# EAGLE design receiver (EAGLE 6.5.0)
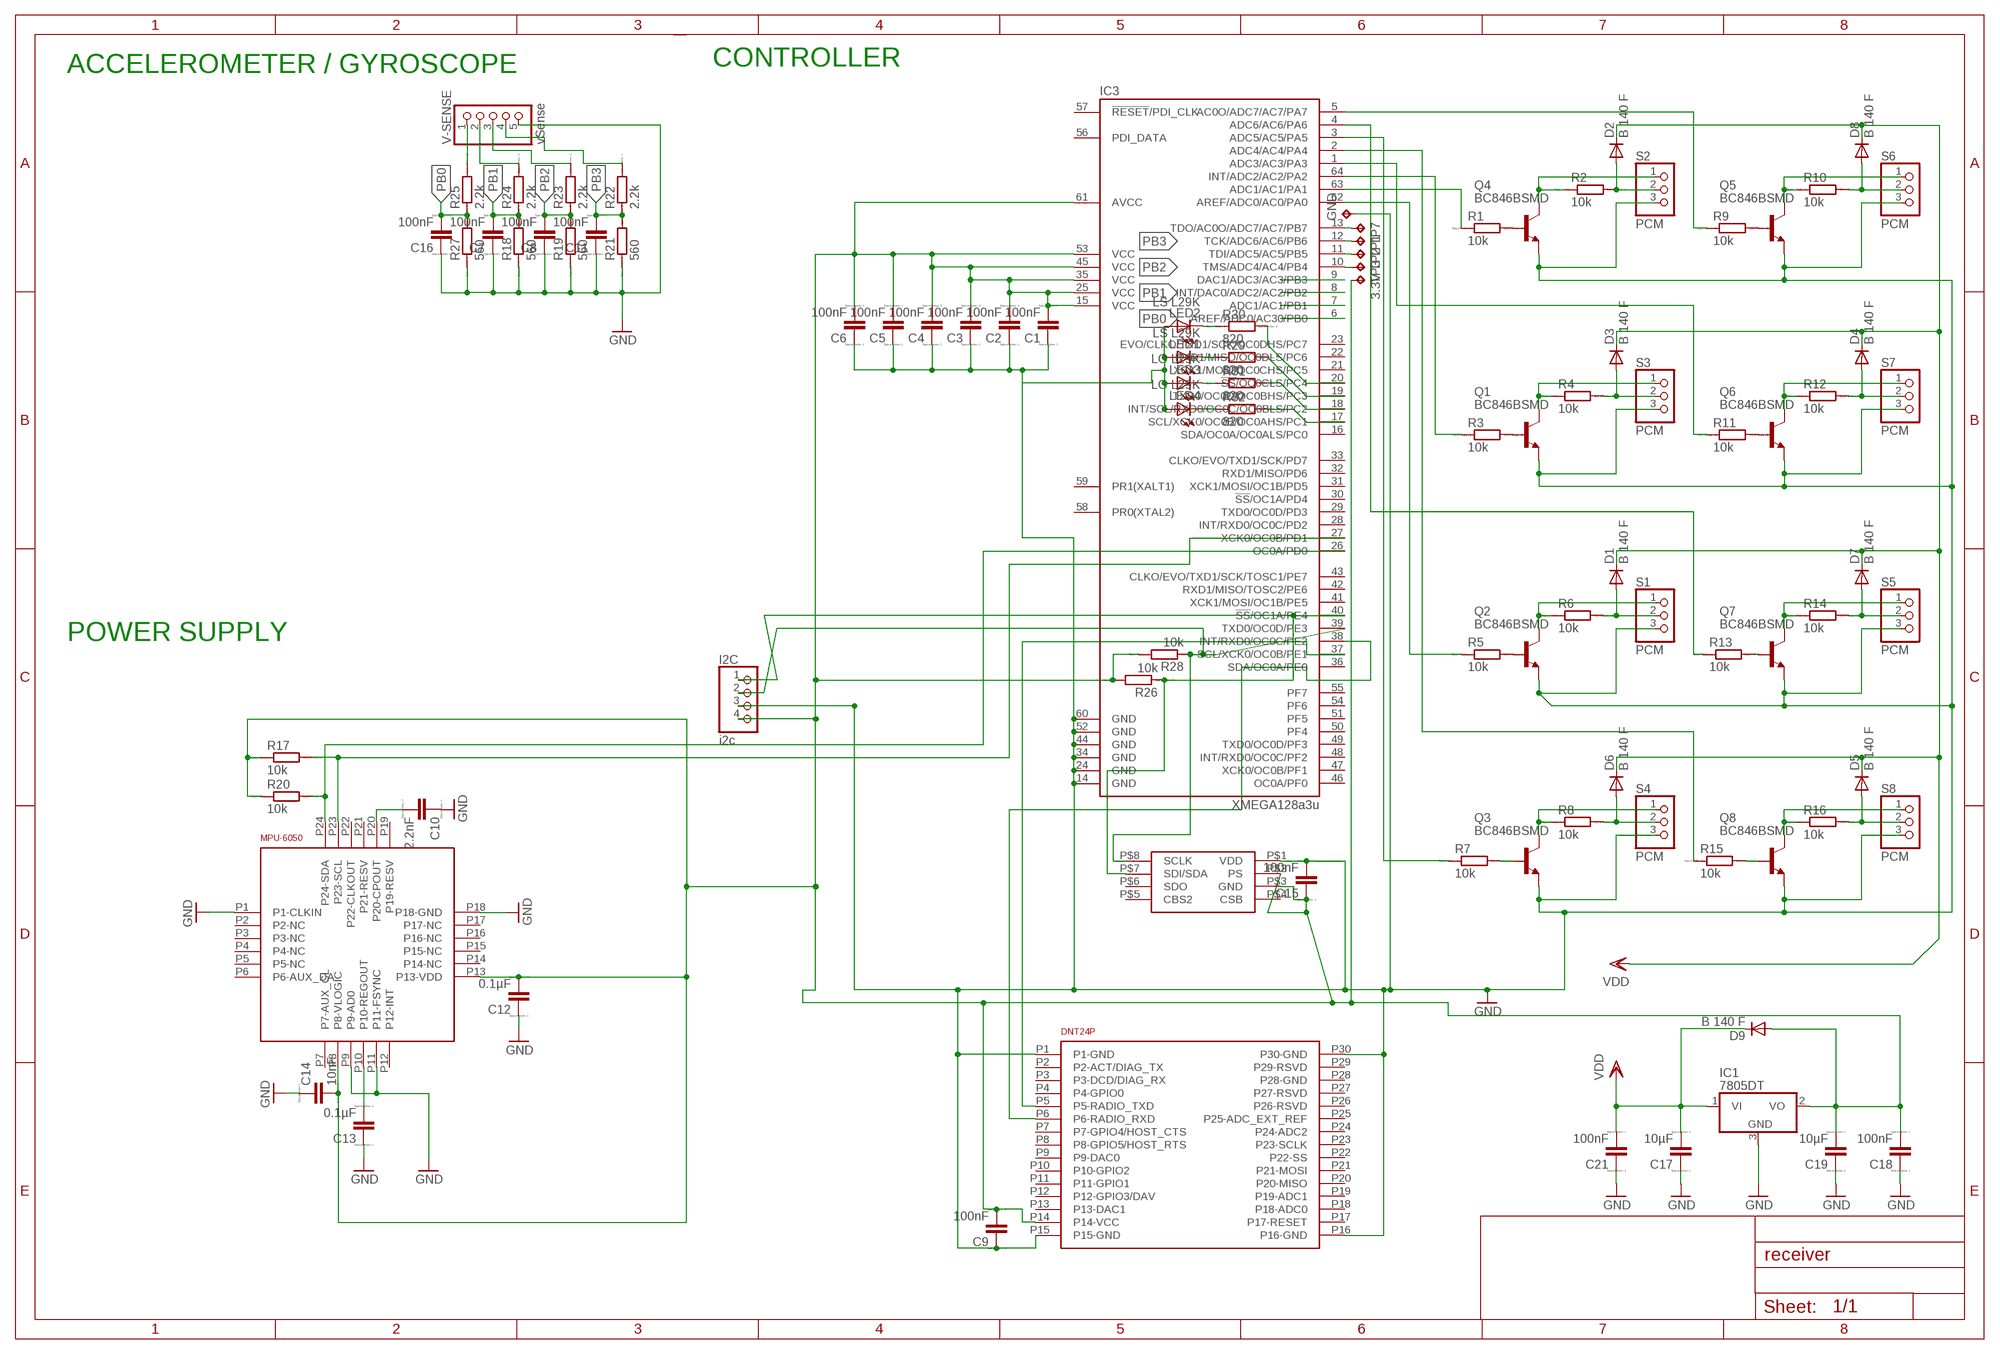
[diagram p0: schematic, sheet 1]

## Parts
3.3V  TPTP08R  [TP08R]
C1  100nF  CC0603  [C0603]
C2  100nF  CC0603  [C0603]
C3  100nF  CC0603  [C0603]
C4  100nF  CC0603  [C0603]
C5  100nF  CC0603  [C0603]
C6  100nF  CC0603  [C0603]
C7  100nF  CC0603  [C0603]
C8  100nF  CC0603  [C0603]
C9  100nF  CC0603  [C0603]
C10  2.2nF  CC0603  [C0603]
C11  100nF  CC0603  [C0603]
C12  0.1µF  CC0603  [C0603]
C13  0.1µF  CC0603  [C0603]
C14  10nF  CC0603  [C0603]
C15  100nF  CC0603  [C0603]
C16  100nF  CC0603  [C0603]
C17  10µF  CC0603  [C0603]
C18  100nF  CC0603  [C0603]
C19  10µF  CC0603  [C0603]
C21  100nF  CC0603  [C0603]
D1  B 140 F  CGRM4001-G  [SOD-123_MINI-SMA]
D2  B 140 F  CGRM4001-G  [SOD-123_MINI-SMA]
D3  B 140 F  CGRM4001-G  [SOD-123_MINI-SMA]
D4  B 140 F  CGRM4001-G  [SOD-123_MINI-SMA]
D5  B 140 F  CGRM4001-G  [SOD-123_MINI-SMA]
D6  B 140 F  CGRM4001-G  [SOD-123_MINI-SMA]
D7  B 140 F  CGRM4001-G  [SOD-123_MINI-SMA]
D8  B 140 F  CGRM4001-G  [SOD-123_MINI-SMA]
D9  B 140 F  CGRM4001-G  [SOD-123_MINI-SMA]
GND  TPTP08R  [TP08R]
I2C  i2c  PINHD-1X4/90  [1X04/90]
IC1  7805DT  [TO252]
IC3  XMEGA128a3u  ATXMEGA##A3-64A  [TQFP-64]
LED1  LS L29K  LEDCHIP-LED0603  [CHIP-LED0603]
LED2  LS L29K  LEDCHIP-LED0603  [CHIP-LED0603]
LED3  LO L29K  LEDCHIP-LED0603  [CHIP-LED0603]
LED4  LG L29K  LEDCHIP-LED0603  [CHIP-LED0603]
Q1  BC846BSMD  [SOT23]
Q2  BC846BSMD  [SOT23]
Q3  BC846BSMD  [SOT23]
Q4  BC846BSMD  [SOT23]
Q5  BC846BSMD  [SOT23]
Q6  BC846BSMD  [SOT23]
Q7  BC846BSMD  [SOT23]
Q8  BC846BSMD  [SOT23]
R1  10k  RR0603  [R0603]
R2  10k  RR0603  [R0603]
R3  10k  RR0603  [R0603]
R4  10k  RR0603  [R0603]
R5  10k  RR0603  [R0603]
R6  10k  RR0603  [R0603]
R7  10k  RR0603  [R0603]
R8  10k  RR0603  [R0603]
R9  10k  RR0603  [R0603]
R10  10k  RR0603  [R0603]
R11  10k  RR0603  [R0603]
R12  10k  RR0603  [R0603]
R13  10k  RR0603  [R0603]
R14  10k  RR0603  [R0603]
R15  10k  RR0603  [R0603]
R16  10k  RR0603  [R0603]
R17  10k  RR0603  [R0603]
R18  560  RR0603  [R0603]
R19  560  RR0603  [R0603]
R20  10k  RR0603  [R0603]
R21  560  RR0603  [R0603]
R22  2.2k  RR0603  [R0603]
R23  2.2k  RR0603  [R0603]
R24  2.2k  RR0603  [R0603]
R25  2.2k  RR0603  [R0603]
R26  10k  RR0603  [R0603]
R27  560  RR0603  [R0603]
R28  10k  RR0603  [R0603]
R29  820  RR0603  [R0603]
R30  820  RR0603  [R0603]
R31  820  RR0603  [R0603]
R32  820  RR0603  [R0603]
S1  PCM  PINHD-1X3  [1X03]
S2  PCM  PINHD-1X3  [1X03]
S3  PCM  PINHD-1X3  [1X03]
S4  PCM  PINHD-1X3  [1X03]
S5  PCM  PINHD-1X3  [1X03]
S6  PCM  PINHD-1X3  [1X03]
S7  PCM  PINHD-1X3  [1X03]
S8  PCM  PINHD-1X3  [1X03]
TP1  TPTP08R  [TP08R]
TP2  TPTP08R  [TP08R]
TP3  TPTP08R  [TP08R]
TP7  TPTP08R  [TP08R]
U$1  DNT24P_RADIO_MODULE  [DNT24P_RADIO_MODULE]
U$2  MS5611  [01BA03]
U$3  MPU-6050_ACC_GYRO  [MPU-6050_ACC_GYRO]
V-SENSE  vSense  PINHD-1X5/90  [1X05/90]

## Nets
GND: C1.1 C2.1 C3.1 C4.1 C5.1 C6.1 C7.1 C8.1 C9.1 C10.1 C11.1 C12.1 C13.1 C14.1 C15.2 C16.1 C17.1 C18.1 C19.1 C21.1 GND.TP I2C.3 IC1.3(GND) IC3.14(GND) IC3.24(GND) IC3.34(GND) IC3.44(GND) IC3.52(GND) IC3.60(GND) LED1.A LED2.A LED3.A LED4.A Q1.2(E) Q2.2(E) Q3.2(E) Q4.2(E) Q5.2(E) Q6.2(E) Q7.2(E) Q8.2(E) R18.1 R19.1 R21.1 R27.1 S1.3 S2.3 S3.3 S4.3 S5.3 S6.3 S7.3 S8.3 U$1.P1(P1-GND) U$1.P15(P15-GND) U$1.P16(P16-GND) U$1.P30(P30-GND) U$2.P$1(VDD) U$3.P1(P1-CLKIN) U$3.P9(P9-AD0) U$3.P11(P11-FSYNC) U$3.P18(P18-GND) V-SENSE.5
N$1: Q4.1(B) R1.2
N$2: Q1.3(C) R4.1 S3.1
N$3: D3.A R4.2 S3.2
N$4: Q1.1(B) R3.2
N$5: Q2.3(C) R6.1 S1.1
N$6: D1.A R6.2 S1.2
N$7: Q2.1(B) R5.2
N$8: Q3.3(C) R8.1 S4.1
N$9: D6.A R8.2 S4.2
N$10: Q3.1(B) R7.2
N$11: Q5.3(C) R10.1 S6.1
N$12: D8.A R10.2 S6.2
N$13: Q5.1(B) R9.2
N$14: Q4.3(C) R2.1 S2.1
N$15: D2.A R2.2 S2.2
N$16: Q6.3(C) R12.1 S7.1
N$17: D4.A R12.2 S7.2
N$18: Q6.1(B) R11.2
N$19: Q7.3(C) R14.1 S5.1
N$20: D7.A R14.2 S5.2
N$21: Q7.1(B) R13.2
N$22: Q8.3(C) R16.1 S8.1
N$23: D5.A R16.2 S8.2
N$24: Q8.1(B) R15.2
N$25: IC3.63(ADC1/AC1/PA1) R1.1
N$26: IC3.64(INT/ADC2/AC2/PA2) R3.1
N$27: IC3.5(AC0O/ADC7/AC7/PA7) R9.1
N$28: IC3.4(ADC6/AC6/PA6) R13.1
N$29: IC3.62(AREF/ADC0/AC0/PA0) R5.1
N$30: IC3.1(ADC3/AC3/PA3) R11.1
N$31: IC3.2(ADC4/AC4/PA4) R15.1
N$32: IC3.3(ADC5/AC5/PA5) R7.1
N$33: IC3.37(SCL/XCK0/OC0B/PE1) U$1.P5(P5-RADIO_TXD)
N$34: LED1.C R29.1
N$35: C10.2 U$3.P20(P20-CPOUT)
N$36: IC3.38(INT/RXD0/OC0C/PE2) U$1.P6(P6-RADIO_RXD)
N$37: C13.2 U$3.P10(P10-REGOUT)
N$38: IC3.10(TMS/ADC4/AC4/PB4) TP3.TP
N$39: IC3.11(TDI/ADC5/AC5/PB5) TP2.TP
N$40: IC3.12(TCK/ADC6/AC6/PB6) TP1.TP
N$41: IC3.13(TDO/AC0O/ADC7/AC7/PB7) TP7.TP
N$42: R24.2 V-SENSE.2
N$43: R23.2 V-SENSE.3
N$44: R22.2 V-SENSE.4
N$45: IC3.17(SCL/XCK0/OC0B/OC0AHS/PC1) R32.2
N$46: I2C.2 IC3.39(TXD0/OC0D/PE3) R28.1 U$2.P$8(SCLK)
N$47: I2C.1 IC3.40(!SS!/OC1A/PE4) R26.1 U$2.P$7(SDI/SDA)
N$48: IC3.18(INT/SCL/RXD0/OC0C/OC0BLS/PC2) R31.2
N$49: LED3.C R31.1
N$50: R25.2 V-SENSE.1
N$51: LED4.C R32.1
N$52: IC3.19(TXD0/OC0D/OC0BHS/PC3) R29.2
N$53: LED2.C R30.1
N$54: IC3.20(!SS!/OC0CLS/PC4) R30.2
PB0: C16.2 IC3.6(AREF/ADC0/AC30/PB0) R25.1 R27.2
PB1: C7.2 IC3.7(ADC1/AC1/PB1) R18.2 R24.1
PB2: C8.2 IC3.8(INT/DAC0/ADC2/AC2/PB2) R19.2 R23.1
PB3: C11.2 IC3.9(DAC1/ADC3/AC3/PB3) R21.2 R22.1
PF0: IC3.26(OC0A/PD0) R20.2 U$3.P24(P24-SDA)
PF1: IC3.27(XCK0/OC0B/PD1) R17.2 U$3.P23(P23-SCL)
VCC: 3.3V.TP C1.2 C2.2 C3.2 C4.2 C5.2 C6.2 C9.2 C12.2 C14.2 C15.1 C18.2 C19.2 D9.A I2C.4 IC1.2(VO) IC3.15(VCC) IC3.25(VCC) IC3.35(VCC) IC3.45(VCC) IC3.53(VCC) IC3.61(AVCC) R17.1 R20.1 R26.2 R28.2 U$1.P14(P14-VCC) U$2.P$2(PS) U$2.P$3(GND) U$3.P8(P8-VLOGIC) U$3.P13(P13-VDD)
VDD: C17.2 C21.2 D1.C D2.C D3.C D4.C D5.C D6.C D7.C D8.C D9.C IC1.1(VI)
Unconnected: IC3.16(SDA/OC0A/OC0ALS/PC0) IC3.21(XCK1/MOSI/OC0CHS/PC5) IC3.22(RXD1/MISO/OC0DLS/PC6) IC3.23(EVO/CLKO/TXD1/SCK/OC0DHS/PC7) IC3.28(INT/RXD0/OC0C/PD2) IC3.29(TXD0/OC0D/PD3) IC3.30(!SS!/OC1A/PD4) IC3.31(XCK1/MOSI/OC1B/PD5) IC3.32(RXD1/MISO/PD6) IC3.33(CLKO/EVO/TXD1/SCK/PD7) IC3.36(SDA/OC0A/PE0) IC3.41(XCK1/MOSI/OC1B/PE5) IC3.42(RXD1/MISO/TOSC2/PE6) IC3.43(CLKO/EVO/TXD1/SCK/TOSC1/PE7) IC3.46(OC0A/PF0) IC3.47(XCK0/OC0B/PF1) IC3.48(INT/RXD0/OC0C/PF2) IC3.49(TXD0/OC0D/PF3) IC3.50(PF4) IC3.51(PF5) IC3.54(PF6) IC3.55(PF7) IC3.56(PDI_DATA) IC3.57(!RESET!/PDI_CLK) IC3.58(PR0(XTAL2)) IC3.59(PR1(XALT1)) U$1.P2(P2-ACT/DIAG_TX) U$1.P3(P3-DCD/DIAG_RX) U$1.P4(P4-GPIO0) U$1.P7(P7-GPIO4/HOST_CTS) U$1.P8(P8-GPIO5/HOST_RTS) U$1.P9(P9-DAC0) U$1.P10(P10-GPIO2) U$1.P11(P11-GPIO1) U$1.P12(P12-GPIO3/DAV) U$1.P13(P13-DAC1) U$1.P17(P17-RESET) U$1.P18(P18-ADC0) U$1.P19(P19-ADC1) U$1.P20(P20-MISO) U$1.P21(P21-MOSI) U$1.P22(P22-SS) U$1.P23(P23-SCLK) U$1.P24(P24-ADC2) U$1.P25(P25-ADC_EXT_REF) U$1.P26(P26-RSVD) U$1.P27(P27-RSVD) U$1.P28(P28-GND) U$1.P29(P29-RSVD) U$2.P$4(CSB) U$2.P$5(CBS2) U$2.P$6(SDO) U$3.P2(P2-NC) U$3.P3(P3-NC) U$3.P4(P4-NC) U$3.P5(P5-NC) U$3.P6(P6-AUX_DA) U$3.P7(P7-AUX_CL) U$3.P12(P12-INT) U$3.P14(P14-NC) U$3.P15(P15-NC) U$3.P16(P16-NC) U$3.P17(P17-NC) U$3.P19(P19-RESV) U$3.P21(P21-RESV) U$3.P22(P22-CLKOUT)

## Notes on the sheet
- ACCELEROMETER / GYROSCOPE | CONTROLLER
- POWER SUPPLY

## Library data of the parts
3.3V GND TP1-TP3 TP7 = testpad:TP: Test pad
C1-C19 C21 = eagle-ltspice:C: CAPACITOR, European symbol; SPICEMODEL: NONE; SPICEPREFIX: C
D1-D9 = diode:CGRM400*-G: Molded plasitc,JEDEC SOD-123/Mini SMA Source: Comchip CGRM4001-G.pdf
I2C = pinhead:PINHD-1X4: PIN HEADER
IC1 = linear:78*: Positive VOLTAGE REGULATOR Source: http://cache.national.com/ds/LM/LM78L05.pdf http://www.fairchildsemi.com/ds/LM/LM7805.pdf
IC3 = ATxmega__A3:ATXMEGA##A3
LED1-LED4 = led:LED: LED OSRAM: - CHIPLED LG R971, LG N971, LY N971, LG Q971, LY Q971, LO R971, LY R971 LH N974, LH R974 LS Q976, LO Q976, LY Q976 LO Q996 - Hyper CHIPLED LW Q18S LB Q993, LB Q99A, LB R99A - SideLED LS A670, LO A670, LY A670, LG A670, LP A670 LB A673, LV A673, LT A673, LW A673 LH A674 LY A675 LS A676, LA A676, LO A676, LY A676, LW A676 LS A679, LY A679, LG A679 - Hyper Micro SIDELED® LS Y876, LA Y876, LO Y876, LY Y876 LT Y87S - SmartLED LW L88C, LW L88S LB L89C, LB L89S, LG L890 LS L89K, LO L89K, LY L89K LS L896, LA L896, LO L896, LY L896 - TOPLED LS T670, LO T670, LY T670, LG T670, LP T670 LSG T670, LSP T670, LSY T670, LOP T670, LYG T670 LG T671, LOG T671, LSG T671 LB T673, LV T673, LT T673, LW T673 LH T674 LS T676, LA T676, LO T676, LY T676, LB T676, LH T676, LSB T676, LW T676 LB T67C, LV T67C, LT T67C, LS T67K, LO T67K, LY T67K, LW E67C LS E67B, LA E67B, LO E67B, LY E67B, LB E67C, LV E67C, LT E67C LW T67C LS T679, LY T679, LG T679 LS T770, LO T770, LY T770, LG T770, LP T770 LB T773, LV T773, LT T773, LW T773 LH T774 LS E675, LA E675, LY E675, LS T675 LS T776, LA T776, LO T776, LY T776, LB T776 LHGB T686 LT T68C, LB T68C - Hyper Mini TOPLED® LB M676 - Mini TOPLED Santana® LG M470 LS M47K, LO M47K, LY M47K Source: http://www.osram.convergy.de LUXEON: - LUMILED® LXK2-PW12-R00, LXK2-PW12-S00, LXK2-PW14-U00, LXK2-PW14-V00 LXK2-PM12-R00, LXK2-PM12-S00, LXK2-PM14-U00 LXK2-PE12-Q00, LXK2-PE12-R00, LXK2-PE12-S00, LXK2-PE14-T00, LXK2-PE14-U00 LXK2-PB12-K00, LXK2-PB12-L00, LXK2-PB12-M00, LXK2-PB14-N00, LXK2-PB14-P00, LXK2-PB14-Q00 LXK2-PR12-L00, LXK2-PR12-M00, LXK2-PR14-Q00, LXK2-PR14-R00 LXK2-PD12-Q00, LXK2-PD12-R00, LXK2-PD12-S00 LXK2-PH12-R00, LXK2-PH12-S00 LXK2-PL12-P00, LXK2-PL12-Q00, LXK2-PL12-R00 Source: www.luxeon.com KINGBRIGHT: KA-3528ASYC Source: www.kingbright.com
Q1-Q8 = transistor-npn:BC846*: NPN Transistor
R1-R32 = eagle-ltspice:R: RESISTOR, European symbol; SPICEMODEL: NONE; SPICEPREFIX: R
S1-S8 = pinhead:PINHD-1X3: PIN HEADER
U$1 = USER PARTS:DNT24P_RADIO_MODULE
U$2 = ms5611:MS5611
U$3 = USER PARTS:MPU-6050_ACC_GYRO
V-SENSE = pinhead:PINHD-1X5: PIN HEADER

## Net classes
0 gnd: width 0.305 mm, drill 0.5 mm, clearance 0.203 mm

## Board
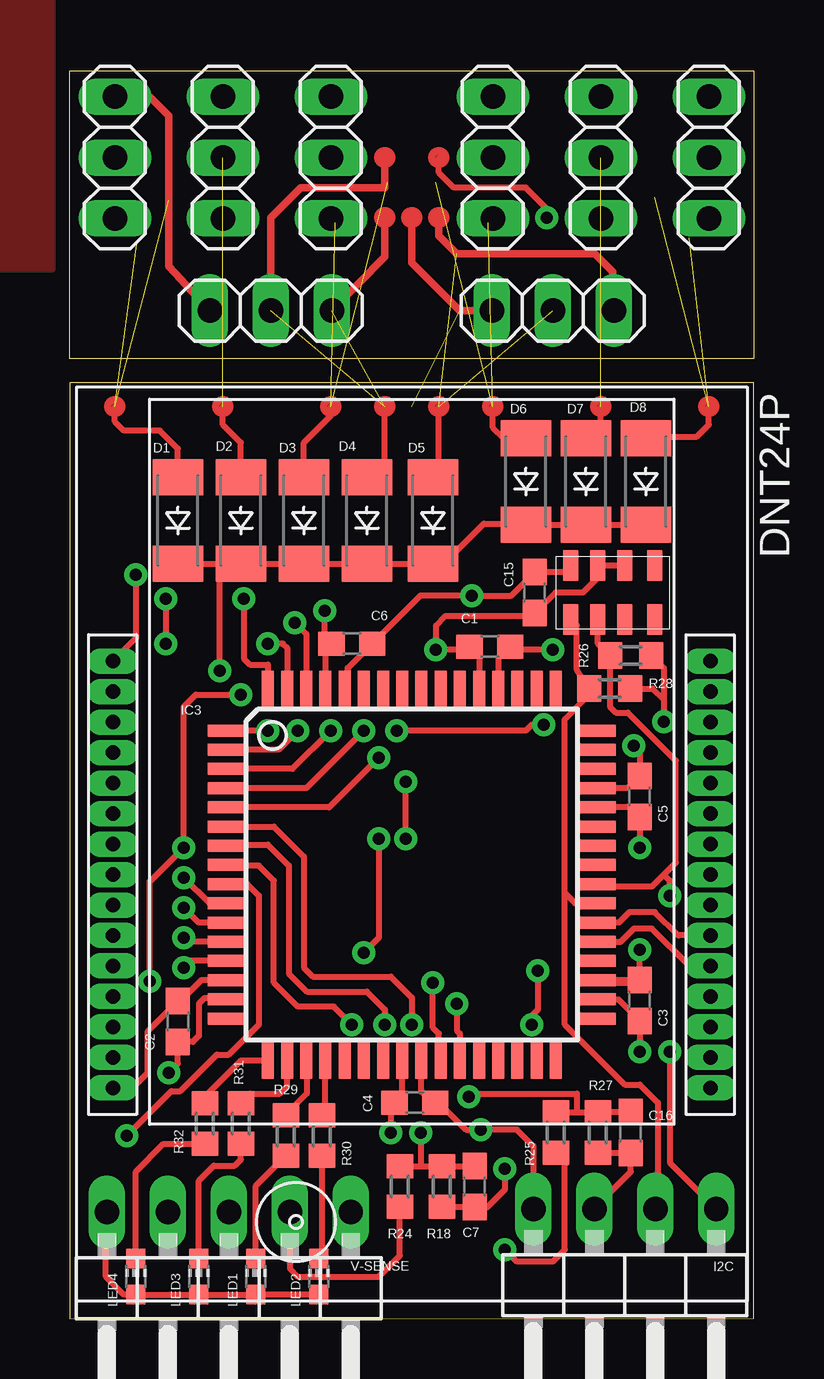
[diagram p1: board, top side]
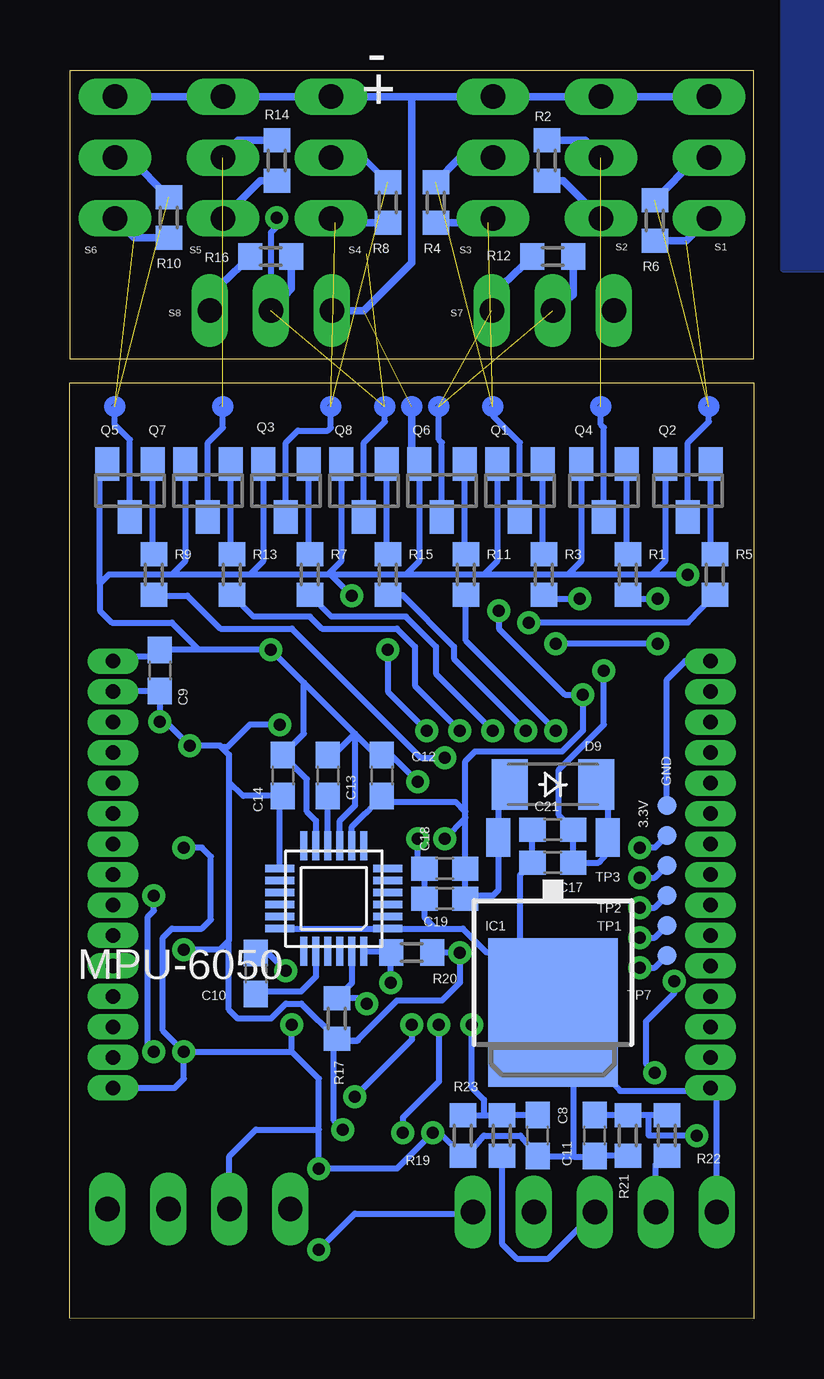
[diagram p2: board, bottom side, seen from below]

Size 28.5 x 52 mm. Coordinates in mm from the lower left corner, seen from the top.
Outline: 28.5,39 0,39 0,0 28.5,0.01 28.5,39
Outline: 0,52 28.5,52 28.5,40 0,40 0,52
Copper layers (1*2+3*4+5*6+7*16): Top 0.035mm / dielectric 0.2mm / Route2 0.035mm / dielectric 0.15mm / Route3 0.035mm / dielectric 0.2mm / Route4 0.035mm / dielectric 0.15mm / Route5 0.035mm / dielectric 0.2mm / Route6 0.035mm / dielectric 0.15mm / Route7 0.035mm / dielectric 0.2mm / Bottom 0.035mm
Design rules "Eagle_WEdirekt_150_check": minimum track width 6mil, minimum drill 0.25mm, track to track 6mil, track to pad 8mil, pad to pad 8mil, via to via 6mil, smd to smd 8mil, copper to edge 12mil, drill to drill 24mil, minimum pad ring 9mil, minimum via ring 9mil, stop-mask expansion 3mil, vias tented up to drill 0mil, thermal gap 12mil

### Footprints (pad centres in the part's own frame; a part is rotated, then mirrored left to right if it is on the bottom)
TP08R = smd 0.8 x 0.8: TP 0,0
C0603 = smd 1.1 x 1: 1 -0.85,0; 2 0.85,0
SOD-123_MINI-SMA = smd 1.5 x 2.1: A 1.8,0; C -1.8,0
1X04/90 = drill 1.016 long: 1 -3.81,-3.81; 2 -1.27,-3.81; 3 1.27,-3.81; 4 3.81,-3.81
TO252 = smd 1 x 1.6: 1 -2.28,-4.8; 2 2.28,-4.8 | smd 5.4 x 6.2: 3 0,2.5
TQFP-64 = smd 1.5 x 0.5: 1 -7.75,6; 2 -7.75,5.2; 3 -7.75,4.4; 4 -7.75,3.6; 5 -7.75,2.8; 6 -7.75,2; 7 -7.75,1.2; 8 -7.75,0.4; 9 -7.75,-0.4; 10 -7.75,-1.2; 11 -7.75,-2; 12 -7.75,-2.8; 13 -7.75,-3.6; 14 -7.75,-4.4; 15 -7.75,-5.2; 16 -7.75,-6; 33 7.75,-6; 34 7.75,-5.2; 35 7.75,-4.4; 36 7.75,-3.6; 37 7.75,-2.8; 38 7.75,-2; 39 7.75,-1.2; 40 7.75,-0.4; 41 7.75,0.4; 42 7.75,1.2; 43 7.75,2; 44 7.75,2.8; 45 7.75,3.6; 46 7.75,4.4; 47 7.75,5.2; 48 7.75,6 | smd 0.5 x 1.5: 17 -6,-7.75; 18 -5.2,-7.75; 19 -4.4,-7.75; 20 -3.6,-7.75; 21 -2.8,-7.75; 22 -2,-7.75; 23 -1.2,-7.75; 24 -0.4,-7.75; 25 0.4,-7.75; 26 1.2,-7.75; 27 2,-7.75; 28 2.8,-7.75; 29 3.6,-7.75; 30 4.4,-7.75; 31 5.2,-7.75; 32 6,-7.75; 49 6,7.75; 50 5.2,7.75; 51 4.4,7.75; 52 3.6,7.75; 53 2.8,7.75; 54 2,7.75; 55 1.2,7.75; 56 0.4,7.75; 57 -0.4,7.75; 58 -1.2,7.75; 59 -2,7.75; 60 -2.8,7.75; 61 -3.6,7.75; 62 -4.4,7.75; 63 -5.2,7.75; 64 -6,7.75
CHIP-LED0603 = smd 0.8 x 0.8: A 0,-0.75; C 0,0.75
SOT23 = smd 1 x 1.4: 1 -0.95,-1.1; 2 0.95,-1.1; 3 0,1.1
R0603 = smd 1 x 1.1: 1 -0.85,0; 2 0.85,0
1X03 = drill 1.016 long: 1 -2.54,0; 2 0,0; 3 2.54,0
DNT24P_RADIO_MODULE = drill 0.6 pad 0.889 long: P1 8.89,12.446; P2 7.62,12.446; P3 6.35,12.446; P4 5.08,12.446; P5 3.81,12.446; P6 2.54,12.446; P7 1.27,12.446; P8 0,12.446; P9 -1.27,12.446; P10 -2.54,12.446; P11 -3.81,12.446; P12 -5.08,12.446; P13 -6.35,12.446; P14 -7.62,12.446; P15 -8.89,12.446; P16 -8.89,-12.446; P17 -7.62,-12.446; P18 -6.35,-12.446; P19 -5.08,-12.446; P20 -3.81,-12.446; P21 -2.54,-12.446; P22 -1.27,-12.446; P23 0,-12.446; P24 1.27,-12.446; P25 2.54,-12.446; P26 3.81,-12.446; P27 5.08,-12.446; P28 6.35,-12.446; P29 7.62,-12.446; P30 8.89,-12.446
01BA03 = smd 1.27 x 0.635: P$1 2.625,4.125; P$2 2.625,3; P$3 2.625,1.875; P$4 2.625,0.625; P$5 0.375,0.625; P$6 0.375,1.875; P$7 0.375,3; P$8 0.375,4.125
MPU-6050_ACC_GYRO = smd 1.2 x 0.3: P1 -2.25,1.25; P2 -2.25,0.75; P3 -2.25,0.25; P4 -2.25,-0.25; P5 -2.25,-0.75; P6 -2.25,-1.25; P13 2.25,-1.25; P14 2.25,-0.75; P15 2.25,-0.25; P16 2.25,0.25; P17 2.25,0.75; P18 2.25,1.25 | smd 0.3 x 1.2: P7 -1.25,-2.2; P8 -0.75,-2.2; P9 -0.25,-2.2; P10 0.25,-2.2; P11 0.75,-2.2; P12 1.25,-2.2; P19 1.25,2.2; P20 0.75,2.2; P21 0.25,2.2; P22 -0.25,2.2; P23 -0.75,2.2; P24 -1.25,2.2
1X05/90 = drill 1.016 long: 1 -5.08,-3.81; 2 -2.54,-3.81; 3 0,-3.81; 4 2.54,-3.81; 5 5.08,-3.81

### Placement (x,y rotation side)
3.3V  3.62,20.12 90 bottom
C1  17.5,28 180 top
C2  4.5,12.38 270 top
C3  23.75,13.25 90 top
C4  14.38,9 0 top
C5  23.75,21.75 90 top
C6  11.75,28.12 180 top
C7  16.88,5.5 90 top
C8  9,7.62 90 bottom
C9  24.75,27 270 bottom
C10  20.75,14.38 270 bottom
C11  6.62,7.62 90 bottom
C12  15.5,22.62 270 bottom
C13  17.75,22.62 270 bottom
C14  19.62,22.62 270 bottom
C15  19.38,30.25 90 top
C16  23.38,7.75 90 top
C17  8.38,19 0 bottom
C18  12.88,18.75 0 bottom
C19  12.88,17.5 0 bottom
C21  8.38,20.38 0 bottom
D1  4.5,33.25 90 top
D2  7.12,33.25 90 top
D3  9.75,33.25 90 top
D4  12.38,33.25 90 top
D5  15.12,33.25 90 top
D6  19,34.88 90 top
D7  21.5,34.88 90 top
D8  24,34.88 90 top
D9  8.38,22.25 180 bottom
GND  3.62,21.38 90 bottom
I2C  23.12,0.75 180 top
IC1  8.38,15.25 180 bottom
IC3  14.25,18.5 0 top
LED1  7.75,1.75 0 top
LED2  10.38,1.75 0 top
LED3  5.38,1.75 0 top
LED4  2.75,1.75 0 top
Q1  9.75,34.5 180 bottom
Q2  2.75,34.5 180 bottom
Q3  19.5,34.5 180 bottom
Q4  6.25,34.5 180 bottom
Q5  26,34.5 180 bottom
Q6  13,34.5 180 bottom
Q7  22.75,34.5 180 bottom
Q8  16.25,34.5 180 bottom
R1  5.25,31 90 bottom
R2  8.62,48.25 90 bottom
R3  8.75,31 90 bottom
R4  13.25,46.5 90 bottom
R5  1.62,31 90 bottom
R6  4.12,45.75 90 bottom
R7  18.5,31 90 bottom
R8  15.25,46.5 90 bottom
R9  25,31 90 bottom
R10  24.38,45.88 90 bottom
R11  12,31 90 bottom
R12  8.38,44.25 0 bottom
R13  21.75,31 90 bottom
R14  19.88,48.25 90 bottom
R15  15.25,31 90 bottom
R16  20.12,44.25 0 bottom
R17  17.38,12.5 90 bottom
R18  15.5,5.5 90 top
R19  12.12,7.62 90 bottom
R20  14.25,15.25 180 bottom
R21  5.25,7.62 90 bottom
R22  3.62,7.62 270 bottom
R23  10.5,7.62 270 bottom
R24  13.75,5.5 270 top
R25  20.25,7.75 270 top
R26  23.38,27.62 0 top
R27  22,7.75 90 top
R28  22.5,26.25 0 top
R29  9,7.62 90 top
R30  10.5,7.62 90 top
R31  7.12,8.12 90 top
R32  5.62,8.12 90 top
S1  1.88,48.38 90 top
S2  6.38,48.38 90 top
S3  10.88,48.38 90 top
S4  17.62,48.38 90 top
S5  22.12,48.38 90 top
S6  26.62,48.38 90 top
S7  8.38,42 180 top
S8  20.12,42 180 top
TP1  3.62,16.38 90 bottom
TP2  3.62,17.62 90 bottom
TP3  3.62,18.88 90 bottom
TP7  3.62,15.12 90 bottom
U$1  14.25,18.5 270 top
U$2  25,28.75 90 top
U$3  17.5,17.5 180 bottom
V-SENSE  6.62,0.62 180 top

### Tracks (layer width: path | path; a pad name or v marks a point on that pad's centre or on a via)
GND  (via drill 0.5)  (1 unrouted)
  Top 0.254: v2.75,31 2.75,28.34 U$1.P16 | C6.1 12.47,27.9 12.75,28.05 | v23.75,19.62 C5.1 23.35,21.3 IC3.44 | v23.75,11.12 C3.1 22.85,13.3 IC3.34 | C1.1 18.25,28.1 | C6.1 11.57,27.1 IC3.60 | C1.1 17.85,27.5 IC3.52 | IC3.24 13.85,9.45 C4.1 13.38,8.97 v13.38,7.75 | v20.12,27.88 18.48,27.88 C1.1 | R27.1 C16.1 23.38,6.12 21.86,4.61 I2C.3 | R18.1 C7.1 16.9,4.65 16.88,4.62 17.38,4.62 18.12,5.38 v18.12,6.25 | U$2.P$1 20.6,31.1 C15.2 18.4,30.12 v16.75,30.12 14.6,30.12 C6.1 | v19.5,14.5 19.5,12.88 19.25,12.62 v19.25,12.25 | IC3.14 5.47,14.1 4.62,13.25 C2.1 3.25,11.97 3.25,10.25 2.62,9.62 2.44,9.62 U$1.P30 | 12.62,28.12 C6.1 | V-SENSE.5 1.5,4.39 1.5,1.75 2.25,1 LED4.A LED3.A LED1.A LED2.A | v14,20 v14,22.38
  Top 0.305: S1.3 3.33,50.91 4.12,50.12 4.12,43.84 S7.3 | S8.3 16.25,42 14.25,44 14.25,45.88
  Bottom 0.254: v2.75,31 4.25,31 | 4.25,31 7.75,31 | 7.75,31 11.25,31 | 11.25,31 14.5,31 | 14.5,31 17.62,31 | 17.62,31 17.75,31 | 17.75,31 21,31 | 21,31 24.25,31 | 24.25,31 26.88,31 27.25,30.62 | 27.25,35.3 Q5.2 | 7.75,31 7.2,31.55 Q4.2 | Q1.2 10.7,31.55 11.25,31 | 14.5,31 13.95,31.55 Q6.2 14.25,35.9 | 17.75,31 17.2,31.55 Q8.2 17.2,36.05 | Q3.2 20.45,31.55 21,31 | Q7.2 23.7,31.55 24.25,31 | U$1.P15 26.49,27.6 25,27.6 C9.1 24.73,27.88 23.12,27.88 | 23.12,27.88 v20.12,27.88 18.75,26.5 | v23.75,19.62 23,19.62 22.62,19.25 22.62,16.62 23,16.25 24.25,16.25 24.62,15.88 24.62,12 v23.75,11.12 | 19.25,11.12 18.12,10 18.12,7.88 | 16.62,24.38 16.62,21.38 17.25,20.75 U$3.P9 | 27.25,30.62 27.25,29.5 26.75,29 24.25,29 23.12,27.88 | 13.25,16.25 U$3.P1 U$3.P18 | 13.25,16.25 12.12,16.25 11.12,15.25 10,15.25 9.75,15 | U$3.P11 18.25,20.75 18.62,21.12 18.62,22.48 C14.1 19.62,23.5 18.75,24.38 18.75,26.5 | 27.25,30.62 27.25,35 26.95,35.3 Q5.2 | 7.5,10 8.75,10 | V-SENSE.5 1.54,9.35 U$1.P30 1.93,9.48 5.57,9.48 6.56,10.47 6.26,11.99 | 18.12,7.88 v18.12,6.25 14.88,6.25 v13.38,7.75 13.1,7.75 R19.1 11.9,6.5 11.9,6.85 11.25,7.62 9.72,7.62 C8.1 8.47,6.75 7.5,6.75 | 4.25,31 3.7,31.55 Q2.2 | 17.62,31 v16.75,30.12 | v19.5,14.5 20.23,15.22 C10.1 | v23.75,11.12 19.25,11.12 | U$1.P16 2.86,27.39 3.62,26.62 GND.TP | 16.62,24.38 17.38,23.62 17.38,23.5 17.6,23.38 C13.1 17.9,23.73 | 9.75,15 9.75,12.5 IC1.3 6.5,12.22 6.26,11.99 | 9.25,20 C21.1 C17.1 9.75,18.48 9.75,15 | 16.62,24.38 15.88,23.62 15.78,23.5 C12.1 15.1,23.48 v14,22.38 | 13.25,16.25 13.72,16.73 C19.1 C18.1 14,18.9 v14,20 | 19.25,11.12 v19.25,12.25 | U$1.P1 24.14,9.61 23.75,10 v23.75,11.12 | 27.25,35.9 Q5.2
  Bottom 0.254: R21.1 C11.1 6.65,6.75 7.5,6.75 | 7.5,6.75 7.5,10 | 7.5,10 7.5,10.75 6.26,11.99 | 16.62,24.38 18.75,26.5 | I2C.3 21.86,6.77 20.75,7.88 18.12,7.88
  Bottom 0.305: S1.3 S2.3 S3.3 14.25,50.91 | S4.3 S5.3 S6.3 | S8.3 16.25,42 14.25,44 14.25,50.91 | 16.66,50.91 S4.3 | 14.25,38 14.25,35.9 | 14.25,50.91 S4.3
N$1
  Bottom 0.254: R1.2 5.3,32.02 Q4.1
N$2  (1 unrouted)
  Bottom 0.254: Q1.3 9.75,36.5 10.88,37.62 10.88,38
  Bottom 0.305: R4.1 11.06,45.65 S3.1
N$3  (1 unrouted)
  Top 0.254: D3.A 9.75,36.5 10.88,37.62 10.88,38
  Bottom 0.305: R4.2 12.28,48.35 S3.2
N$4
  Bottom 0.254: R3.2 8.8,32.15 Q1.1
N$5  (1 unrouted)
  Bottom 0.254: Q2.3 2.75,36.5 1.88,37.38 1.88,38
  Bottom 0.305: R6.1 2.81,44.9 S1.1
N$6  (1 unrouted)
  Top 0.254: D1.A 4.5,36.25 3.75,37 2.25,37 1.88,37.38 1.88,38
  Bottom 0.305: R6.2 2.4,48.35 S1.2
N$7
  Bottom 0.254: R5.2 1.8,32.02 Q2.1
N$8  (1 unrouted)
  Bottom 0.254: Q3.3 19.5,36.5 19,37 17.75,37 17.62,37.12 17.62,38
  Bottom 0.305: R8.1 17.43,45.65 S4.1
N$9  (1 unrouted)
  Top 0.254: 17.62,38 17.62,37.12 18.07,36.67 D6.A
  Bottom 0.254: S4.2 16.27,48.38 R8.2
N$10
  Bottom 0.254: R7.2 18.55,32.27 Q3.1
N$11  (1 unrouted)
  Bottom 0.254: Q5.3 26,36.62 26.62,37.25 26.62,38
  Bottom 0.305: R10.1 25.81,45.02 S6.1
N$12  (1 unrouted)
  Top 0.254: D8.A 24.12,36.75 26.12,36.75 26.62,37.25 26.62,38
  Bottom 0.305: R10.2 25.98,48.35 S6.2
N$13
  Bottom 0.254: R9.2 25.05,31.9 Q5.1
N$14  (1 unrouted)
  Bottom 0.254: Q4.3 6.25,37.12 6.38,37.25 6.38,38
  Bottom 0.305: R2.1 7.94,47.4 S2.1
N$15  (1 unrouted)
  Top 0.254: D2.A 7.12,36.5 6.38,37.25 6.38,38
  Bottom 0.305: R2.2 7.03,49.1 S2.2
N$16  (1 unrouted)
  Top 0.305: S7.1 13.12,44.25 13.12,45.88
  Bottom 0.254: Q6.3 13,36.5 13.12,36.62 13.12,38
  Bottom 0.305: R12.1 10.85,42.69 S7.1
N$17  (1 unrouted)
  Top 0.254: D4.A 13.12,35.62 13.12,38
  Top 0.305: S7.2 8.38,45.88 9.62,47.12 13.12,47.12 13.12,48.38
  Bottom 0.305: R12.2 7.53,42.65 S7.2
N$18
  Bottom 0.254: R11.2 12.05,32.02 Q6.1
N$19  (1 unrouted)
  Bottom 0.254: Q7.3 22.75,36.5 22.12,37.12 22.12,38
  Bottom 0.305: R14.1 20.56,47.4 S5.1
N$20  (1 unrouted)
  Top 0.254: D7.A 21.5,36.5 22.12,37 22.12,38
  Bottom 0.305: R14.2 21.48,49.1 S5.2
N$21
  Bottom 0.254: R13.2 21.8,32.15 Q7.1
N$22  (1 unrouted)
  Top 0.305: S8.1 22.62,43.62 21.88,44.38 16.12,44.38 15.38,45.12 15.38,45.88
  Bottom 0.254: Q8.3 16.25,36.5 15.38,37.38 15.38,38
  Bottom 0.305: R16.1 22.6,42.69 S8.1
N$23  (via drill 0.5)  (1 unrouted)
  Top 0.254: D5.A 15.38,35.62 15.38,38 | v19.88,45.88 19.88,46.25 19,47.12 16,47.12 15.38,47.75 15.38,48.38
  Bottom 0.254: v19.88,45.88 19.88,45.5 20.12,45.25 S8.2
  Bottom 0.305: R16.2 19.27,42.9 S8.2
N$24
  Bottom 0.254: R15.2 15.3,32.27 Q8.1
N$25  (via drill 0.5, 0.5 pad 0.25)
  Top 0.254: v4,30 v4,28.12 | IC3.63 9.05,27.95 8.88,28.12 v8.25,28.12
  Bottom 0.254: R1.1 4.75,30 v4,30 | v4,28.12 v8.25,28.12
N$26  (via drill 0.5)
  Top 0.254: v7.25,30 7.25,27.5 7.5,27.25 8.25,27.25 IC3.64
  Bottom 0.254: R3.1 8.62,30.02 8.62,30 v7.25,30
N$27  (via drill 0.5)
  Top 0.254: v12.88,23.38 10.8,21.3 IC3.5
  Bottom 0.254: R9.1 24.88,30.12 23.6,30.12 22.23,28.75 19.25,28.75 13.88,23.38 v12.88,23.38
N$28  (via drill 0.5)
  Top 0.254: v12.25,24.5 9.85,22.1 IC3.4
  Bottom 0.254: 21.65,30.25 R13.1 20.85,29.25 18.5,29.25 18,28.75 14.88,28.75 14.12,28 14.12,26.38 v12.25,24.5
N$29  (via drill 0.5)
  Top 0.254: IC3.62 9.85,28.52 v9.38,29
  Bottom 0.254: R5.1 2.75,29 v9.38,29
N$30  (via drill 0.5)
  Top 0.254: v8.25,24.5 IC3.1
  Bottom 0.254: v8.25,24.5 12,28.25 R11.1
N$31  (via drill 0.5)
  Top 0.254: v9.5,24.5 8.7,23.7 IC3.2
  Bottom 0.254: R15.1 14.65,30.15 12.5,28 12.5,27.5 v9.5,24.5
N$32  (via drill 0.5)
  Top 0.254: v10.88,24.5 9.28,22.9 IC3.3
  Bottom 0.254: v10.88,24.5 13.25,26.88 13.25,28 14.5,29.25 17.6,29.25 R7.1
N$33
  Top 0.254: U$1.P5 25.81,14.69 24.25,16.25 23.5,16.25 22.94,15.69 22.01,15.69 IC3.37
N$34
  Top 0.254: LED1.C 7.75,5.53 R29.1
N$35
  Bottom 0.254: 20.73,13.53 C10.2 | U$3.P20 18.25,14.25 18.88,13.62 20.52,13.62 C10.2 | 20.6,13.53 C10.2
N$36
  Top 0.254: U$1.P6 25.35,15.96 24.38,16.94 23.31,16.94 22.88,16.5 IC3.38
N$37
  Bottom 0.254: U$3.P10 C13.2
N$38  (via drill 0.5)
  Top 0.254: IC3.10 5.83,17.3 v4.75,18.38
  Bottom 0.254: v4.75,18.38 4.12,18.38 TP3.TP
N$39  (via drill 0.5)
  Top 0.254: IC3.11 5.38,16.5 v4.75,17.12
  Bottom 0.254: v4.75,17.12 4.12,17.12 TP2.TP
N$40  (via drill 0.5)
  Top 0.254: IC3.12 4.92,15.7 v4.75,15.88
  Bottom 0.254: v4.75,15.88 4.12,15.88 TP1.TP
N$41  (via drill 0.5)
  Top 0.254: IC3.13 5.03,14.9 v4.75,14.62
  Bottom 0.254: v4.75,14.62 4.12,14.62 TP7.TP
N$42
  Top 0.254: V-SENSE.2 9.16,2.08 9.5,1.75 12.88,1.75 13.75,2.62 R24.2
N$43
  Bottom 0.254: R23.2 10.5,3.12 9.88,2.5 8.56,2.5 V-SENSE.3
N$44
  Bottom 0.254: V-SENSE.4 4.08,6.44 R22.2
N$45
  Top 0.254: IC3.17 7.12,10.75 5.62,9.25 R32.2
N$46
  Top 0.254: R28.1 21.77,25.96 | 21.93,17.38 IC3.39 | 20.62,17.75 20.62,12.25 23.12,9.75 23.75,9.75 24.5,9 24.5,4.71 I2C.2 | 20.62,17.75 20.62,24.98 21.38,25.75 21.38,25.98 R28.1 | IC3.39 21.68,17.3 | IC3.39 21.05,17.3 20.62,17.75 | R28.1 21.12,27.02 21.12,28.88 U$2.P$8
N$47  (via drill 0.5)
  Top 0.254: 22.5,27.62 22.5,25.5 22.75,25.25 23.25,25.25 25.25,23.25 25.25,19 24.75,18.5 | v25,11.12 25,6.5 26.88,4.62 I2C.1 | IC3.40 22,18 24.25,18 24.75,18.5 | R26.1 22.5,27.62 | 22.5,27.62 22,28.12 U$2.P$7 | v25,17.62 25,18.25 24.75,18.5
  Bottom 0.254: v25,11.12 25.25,11.38 25.25,16.75 25,17 v25,17.62
N$48
  Top 0.254: R31.2 7.5,9.38 8.75,9.38 9.05,9.68 IC3.18
N$49
  Top 0.254: LED3.C 5.38,5.75 6,6.38 6.88,6.38 7.12,6.62 R31.1
N$50  (via drill 0.5)
  Top 0.254: R25.2 20.62,6.4 20.62,2.88 20.12,2.38 18.62,2.38 v18.12,2.88
  Bottom 0.254: v18.12,2.88 16.62,4.38 11.77,4.38 V-SENSE.1
N$51
  Top 0.254: LED4.C 2.75,6.12 3.9,7.28 R32.1
N$52
  Top 0.254: IC3.19 9.85,10.5 9.88,9.97 9.88,9.38 R29.2
N$53
  Top 0.254: 10.38,6.78 R30.1 10.5,2.62 LED2.C
N$54
  Top 0.254: R30.2 10.65,8.47 IC3.20
PB0  (via drill 0.5)
  Top 0.254: IC3.6 8.5,20.5 9.75,19.25 9.75,14.62 10.12,14.25 13.38,14.25 14.25,13.38 v14.25,12.25 | C16.2 R27.2 21.12,8.6 | R25.1 21.12,8.6 | v16.62,9.25 16.75,9.38 21.12,9.38 21.12,8.6
  Bottom 0.254: v14.25,12.25 14.25,11.62 v16.62,9.25
PB1  (via drill 0.5)
  Top 0.254: IC3.7 6.67,19.7 7.25,19.75 8.25,19.75 9.12,18.88 9.12,14.38 9.88,13.62 12.38,13.62 13.12,12.88 v13.12,12.25 | R24.1 14.62,6.35 | 14.62,6.35 R18.2 C7.2 | v14.62,7.75 14.62,6.35
  Bottom 0.254: v13.12,12.25 13.12,9.88 14.62,8.38 v14.62,7.75
PB2  (via drill 0.5)
  Top 0.254: v11.75,12.25 11,13 9.5,13 8.5,14 8.5,18.25 7.88,18.88 6.53,18.88 IC3.8
  Bottom 0.254: v11.75,12.25 11.75,9.62 11.25,9.12 11.25,8.47 | R19.2 11.25,8.47 | 11.25,8.47 R23.1 C8.2
PB3  (via drill 0.5)
  Top 0.254: IC3.9 7.4,18.1 7.88,17.62 7.88,12.25 6.62,11 6.12,11 4.6,9.47 4.22,9.47 v2.38,7.62
  Bottom 0.254: R22.1 4.38,8.47 | 4.38,8.47 R21.2 C11.2 | v2.38,7.62 4.38,7.62 4.38,8.47
PF0  (via drill 0.5)
  Top 0.254: IC3.26 15.38,10.55 15.38,11.88 15.12,12.12 v15.12,14
  Bottom 0.254: U$3.P24 15.15,15.3 R20.2 15.12,15.22 v15.12,14
PF1  (via drill 0.5)
  Top 0.254: v16.12,13.12 16.12,12 16.25,11.88 IC3.27
  Bottom 0.254: U$3.P23 16.75,13.97 R17.2 | 17.4,13.4 R17.2 | v16.12,13.12 16.35,13.35 R17.2
POLY1
  pour Bottom: -4.75,55.75 -1.25,55.75 -1.25,43.75 -4.75,43.75
POLY2
  pour Top: -0.75,55.75 -4.25,55.75 -4.25,43.75 -0.75,43.75
VCC  (via drill 0.5, 0.5 pad 0.25)
  Top 0.254: C3.2 IC3.35 22.1,14 23.25,14 23.75,14.5 v23.75,15.38 | v10.62,29.5 10.62,28.1 C6.2 10.65,28 IC3.61 | IC3.45 23.25,22.1 C5.2 23.75,23.62 v23.5,23.88 | IC3.53 17.05,27.6 C1.2 16.62,27.88 v15.25,27.88 15.25,28.88 15.65,29.27 19.5,29.27 C15.1 20.23,30.25 21.38,30.25 22,30.88 U$2.P$2 U$2.P$3 | IC3.25 14.65,9.45 C4.2 15.12,9 15.25,9.12 16.5,7.88 v17.12,7.88 18.62,7.88 19.32,7.18 I2C.4 | 24.23,27.5 R26.2 24.75,27.1 24.75,25.77 | 24.75,25.77 v24.75,24.88 | v19.75,24.75 19.25,24.75 19,24.5 v13.62,24.5 | v12.88,20 12.88,15.88 v12.25,15.25 | v7.12,26 5.25,26 4.75,25.5 v4.75,19.62 3.33,18.2 v3.33,14.05 | IC3.15 6.45,13.35 5.6,13.35 5.38,13.12 5.38,11.78 5.12,11.53 C2.2 4.5,10.62 v4.12,10.25 | R28.2 24.27,26.25 24.75,25.77
  Bottom 0.254: U$1.P14 26.48,26.15 C9.2 v24.75,24.88 24.5,24.88 v23.5,23.88 22.25,23.88 22.19,23.81 | U$3.P8 16.75,20.5 16.25,21 16.1,21.12 C12.2 15.25,21.52 12.43,21.52 12.03,21.12 | 21.88,22.38 21.88,23.5 22.19,23.81 | 21.88,22.38 21.88,15.75 | 21.88,15.75 22.25,15.38 v23.75,15.38 | 21.88,15.75 21.88,12.88 21.5,12.5 20.12,12.5 19.5,13.12 18.85,13.12 R17.1 17.35,11.7 17.25,11.6 16.52,11.6 | v15.25,27.88 15.25,26.12 v13.62,24.5 | v19.75,24.75 21,24.75 21.94,23.81 22.19,23.81 | R20.1 v12.25,15.25 12.25,14 13,13.25 14.88,13.25 16.52,11.6 | C19.2 C18.2 | v10.62,29.5 10.62,28.75 7.88,26 v7.12,26 7.12,24.5 8,23.62 11.62,23.62 12.03,23.23 12.03,21.12 | D9.A 10.62,21.55 10.62,20.52 10.65,20.52 IC1.2 10.65,17.84 10.88,17.62 12.03,17.62 C19.2 | C18.2 12,18.77 | 12.02,17.37 C19.2 | v17.12,7.88 17.5,8.25 17.5,11.57 16.5,11.57 16.52,11.6 | C18.2 12.03,20.88 | 12.03,20.88 12.03,21.12 | v12.88,20 12.03,20.88 | 3.3V.TP 4.12,19.62 v4.75,19.62 | v4.12,10.25 4.5,10.62 4.5,12.38 3.33,13.55 v3.33,14.05 | 21.88,22.38 21.27,21.77 C14.2 19.75,21.4 U$3.P13
VDD  (via drill 0.5)
  Top 0.254: 4.25,31.45 D1.C 6.25,31.45 | 6.25,31.45 D2.C D3.C D4.C D5.C 14.93,31.75 15.62,31.5 17.25,33.12 19.18,33.12 D6.C D7.C D8.C | v6.25,27 6.25,31.45
  Bottom 0.254: v6.25,27 6.25,24.75 8.12,22.88 8.12,20.98 C21.2 C17.2 6.47,19 6.12,19.38 IC1.1 6.09,21.61 D9.C
(copper drawn outside any net)
  shapes: Bottom circle x9, Top circle x13

### Text on the board
bNames: - | +